# EAGLE design LinCorrector1 (EAGLE 7.4.0)
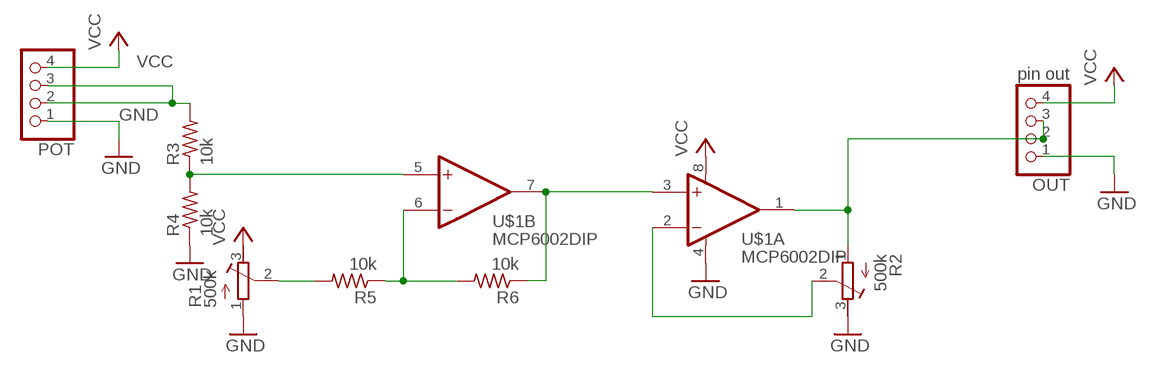
[diagram p0: schematic, sheet 1]

## Parts
OUT  pin out  PINHD-1X4/90  [1X04/90]
POT  PINHD-1X4/90  [1X04/90]
R1  500k  R-TRIMM3296W  [RTRIM3296W]
R2  500k  R-TRIMM3296W  [RTRIM3296W]
R3  10k  R-US_0204/7  [0204/7]
R4  10k  R-US_0204/7  [0204/7]
R5  10k  R-US_0204/7  [0204/7]
R6  10k  R-US_0204/7  [0204/7]
U$1  MCP6002DIP  [DIP-8]

## Nets
GND: OUT.1 POT.1 R1.1(A) R2.3(E) R4.1 U$1.4(A:V-)
N$1: R3.1 R4.2 U$1.5(B:+IN)
N$2: POT.2 POT.3 R3.2
N$3: R1.2(S) R5.2
N$4: R5.1 R6.2 U$1.6(B:-IN)
N$5: R6.1 U$1.3(A:+IN) U$1.7(B:OUT)
N$7: R2.2(S) U$1.2(A:-IN)
N$8: OUT.2 OUT.3 R2.1(A) U$1.1(A:OUT)
VCC: OUT.4 POT.4 R1.3(E) U$1.8(A:V+)

## Library data of the parts
OUT POT = pinhead:PINHD-1X4: PIN HEADER
R1 R2 = resistor:R-TRIMM: Trimm resistor
R3-R6 = rcl:R-US_: RESISTOR, American symbol
U$1 = adam - ics:MCP6002: Dual General Op Amp 1.8V min supply 1MHz (6V/us)

## Net classes
0 default: width 0.381 mm, drill 0.508 mm, clearance 0.381 mm

## Board
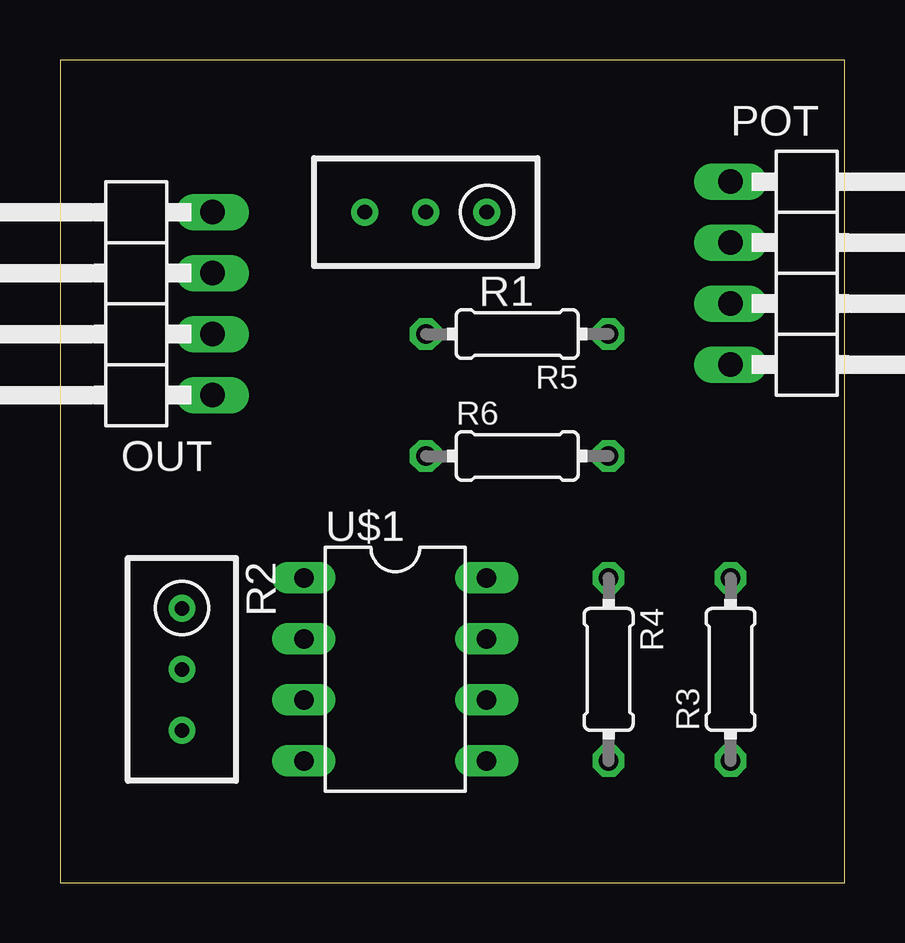
[diagram p1: board, top side]
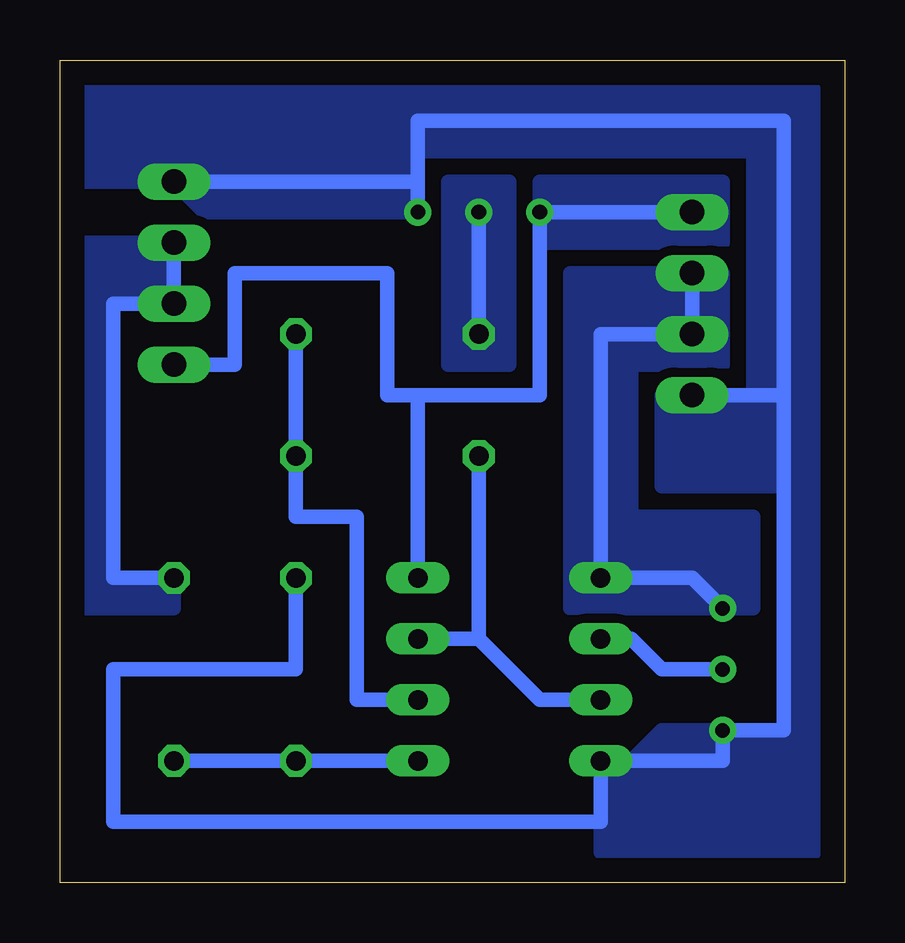
[diagram p2: board, bottom side, seen from below]

Size 32.69 x 34.28 mm. Coordinates in mm from the lower left corner, seen from the top.
Outline: 0,0 32.69,0 32.69,34.28 0,34.28 0,0
Copper layers (1*16): Top 0.035mm / dielectric 1.5mm / Bottom 0.035mm
Design rules "default *": minimum track width 10mil, minimum drill 24mil, track to track 10mil, track to pad 10mil, pad to pad 8mil, via to via 8mil, smd to smd 8mil, copper to edge 40mil, drill to drill 8mil, minimum pad ring 10mil, minimum via ring 8mil, stop-mask expansion 4mil, vias tented up to drill 0mil, thermal gap 10mil

### Footprints (pad centres in the part's own frame; a part is rotated, then mirrored left to right if it is on the bottom)
1X04/90 = drill 1.016 long: 1 -3.81,-3.81; 2 -1.27,-3.81; 3 1.27,-3.81; 4 3.81,-3.81
RTRIM3296W = drill 0.61: 1 0,-2.54; 2 0,0; 3 0,2.54
0204/7 = drill 0.813 octagon: 1 -3.81,0; 2 3.81,0
DIP-8 = drill 0.813 long: 1 -3.81,-3.81; 2 -1.27,-3.81; 3 1.27,-3.81; 4 3.81,-3.81; 5 3.81,3.81; 6 1.27,3.81; 7 -1.27,3.81; 8 -3.81,3.81

### Placement (x,y rotation side)
OUT  2.54,24.13 90 top
POT  31.75,25.4 270 top
R1  15.24,27.94 90 top
R2  5.08,8.89 180 top
R3  27.94,8.89 90 top
R4  22.86,8.89 270 top
R5  19.05,22.86 180 top
R6  19.05,17.78 0 top
U$1  13.97,8.89 270 top

### Tracks (layer width: path | path; a pad name or v marks a point on that pad's centre or on a via)
GND
  Bottom 0.61: POT.1 17.78,29.21 R1.1 17.78,31.75 2.54,31.75 2.54,20.32 | 2.54,20.32 2.54,6.35 R2.3 5.08,5.08 U$1.4 10.16,2.54 30.48,2.54 30.48,8.89 22.86,8.89 R4.1 | 2.54,20.32 OUT.1
  pour Bottom (no thermals): 17.78,27.94 26.67,27.94 27.94,29.21 31.75,29.21 31.75,33.02 17.78,33.02
  pour Bottom (no thermals): 17.78,30.48 3.81,30.48 3.81,20.32 1.27,20.32 1.27,33.02 17.78,33.02
  pour Bottom (no thermals): 1.27,20.32 1.27,1.27 10.16,1.27 10.16,5.08 5.08,5.08 5.08,6.35 2.54,6.35 2.54,20.32
  pour Bottom (no thermals): 10.16,5.08 8.89,5.08 7.62,6.35 5.08,6.35 5.08,3.81 10.16,3.81
  pour Bottom (no thermals): 6.35,20.32 7.62,20.32 7.62,16.51 2.54,16.51 2.54,20.32
N$1
  Bottom 0.61: U$1.5 R4.2 R3.1
N$2
  Bottom 0.61: R3.2 30.48,12.7 30.48,24.13 POT.3 POT.2
  pour Bottom (no thermals): 27.94,26.67 31.75,26.67 31.75,11.43 27.94,11.43 27.94,12.7 30.48,12.7 30.48,24.13 27.94,24.13
N$3
  Bottom 0.61: R1.2 R5.2
  pour Bottom (no thermals): 13.97,21.59 13.97,29.21 16.51,29.21 16.51,21.59
N$4
  Bottom 0.61: U$1.6 20.32,7.62 20.32,15.24 22.86,15.24 R6.2 R5.1
N$5
  Bottom 0.61: U$1.3 12.7,7.62 15.24,10.16 | 15.24,10.16 U$1.7 | R6.1 15.24,10.16
N$7
  Bottom 0.61: U$1.2 8.89,10.16 7.62,8.89 R2.2
N$8
  Bottom 0.61: R2.1 6.35,12.7 U$1.1 10.16,22.86 OUT.2 OUT.3
  pour Bottom (no thermals): 6.35,25.4 11.43,25.4 11.43,13.97 10.16,12.7 10.16,22.86 6.35,22.86
  pour Bottom (no thermals): 10.16,12.7 6.35,12.7 5.08,11.43 5.08,15.24 10.16,15.24
  pour Bottom (no thermals): 8.89,22.86 8.89,15.24 10.16,15.24 10.16,22.86
  pour Bottom (no thermals): 6.35,25.4 5.08,25.4 5.08,21.59 8.89,21.59 8.89,25.4
  pour Bottom (no thermals): 5.08,15.24 3.81,15.24 3.81,11.43 11.43,11.43 11.43,15.24
VCC
  Bottom 0.61: OUT.4 R1.3 12.7,20.32 17.78,20.32 | U$1.8 17.78,20.32 | POT.4 25.4,21.59 25.4,25.4 19.05,25.4 19.05,20.32 17.78,20.32
  pour Bottom (no thermals): 5.08,29.21 12.7,29.21 12.7,26.67 5.08,26.67